# Altium schematic sheet High Voltage H-Bridge.SchDoc: High Voltage H-Bridge
size Letter; Date: 2017-01-26; DocumentNumber: 7; Revision: A; SheetNumber: 7; SheetTotal: 16; DesignedBy: Mike MacKay
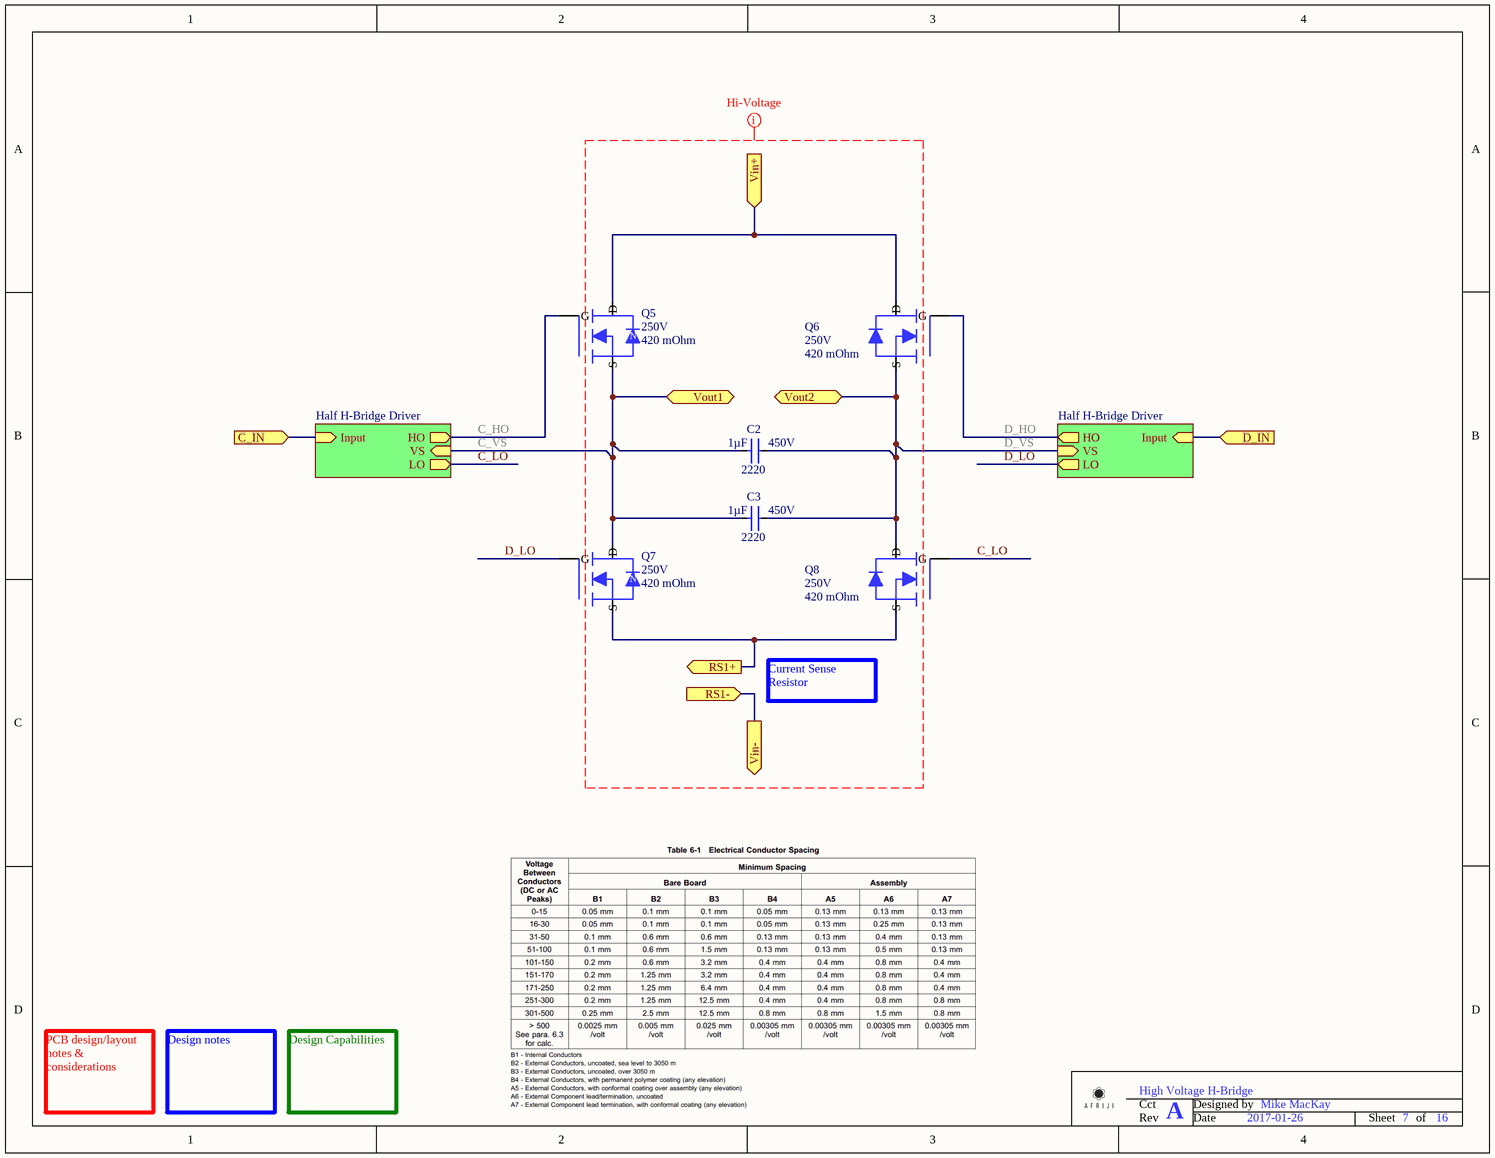
[diagram p0: High Voltage H-Bridge.SchDoc]

## Parts
C2  Capacitance: 1µF  Voltage - Rated: 450V  Package / Case: 2220  [C2220 - Ceramic]  (hidden comment: 1uF 2220 450V)
C3  Capacitance: 1µF  Voltage - Rated: 450V  Package / Case: 2220  [C2220 - Ceramic]  (hidden comment: 1uF 2220 450V)
Q5  Drain to Source Voltage (Vdss): 250V  Rds On (Max) @ Id, Vgs: 420 mOhm  [DPAK]  (hidden comment: N-MOSFET 420mR 250V)
Q6  Drain to Source Voltage (Vdss): 250V  Rds On (Max) @ Id, Vgs: 420 mOhm  [DPAK]  (hidden comment: N-MOSFET 420mR 250V)
Q7  Drain to Source Voltage (Vdss): 250V  Rds On (Max) @ Id, Vgs: 420 mOhm  [DPAK]  (hidden comment: N-MOSFET 420mR 250V)
Q8  Drain to Source Voltage (Vdss): 250V  Rds On (Max) @ Id, Vgs: 420 mOhm  [DPAK]  (hidden comment: N-MOSFET 420mR 250V)

## Sub-sheets
Half H-Bridge Driver = Half H-Bridge Driver.SchDoc: HO (out), VS (in), LO (out), Input (in)
Half H-Bridge Driver = Half H-Bridge Driver.SchDoc: HO (out), VS (in), LO (out), Input (in)

## Ports
C_IN (in), D_IN (in), RS1+ (out), RS1- (in), Vin+ (in), Vin- (out), Vout1 (bidir), Vout2 (bidir)

## Nets
C_HO: Q5.1(G) ; sheet Half H-Bridge Driver/HO
C_IN: port C_IN, sheet Half H-Bridge Driver/Input
C_LO: Q8.1(G) ; sheet Half H-Bridge Driver/LO
C_VS: C2.1 C3.1 Q5.3(S) Q7.2(D) ; port Vout1, sheet Half H-Bridge Driver/VS
D_HO: Q6.1(G) ; sheet Half H-Bridge Driver/HO
D_IN: port D_IN, sheet Half H-Bridge Driver/Input
D_LO: Q7.1(G) ; sheet Half H-Bridge Driver/LO
D_VS: C2.2 C3.2 Q6.3(S) Q8.2(D) ; port Vout2, sheet Half H-Bridge Driver/VS
RS1+: Q7.3(S) Q8.3(S) ; port RS1+
RS1-: port Vin-, port RS1-
Vin+: Q5.2(D) Q6.2(D) ; port Vin+

## Layout directives
net class 171-250V: (no net found under the mark)

## Notes on the sheet
- Current Sense Resistor
- PCB design/layout notes & considerations
- Design notes
- Design Capabilities
- Cct
- Designed by
- Rev
- Date
- Sheet
- of
- (in symbol N-MOSFET 420mR 250V) N

## Library data of the parts
C2 C3 = 1uF 2220 450V: Manufacturer: TDK Corporation; Manufacturer Part Number: CGA9P4X7T2W105M250KE; Tolerance: ±20%; Temperature Coefficient: X7T; Supplier 1: Digi-Key; Supplier Part Number 1: 445-7998-1-ND; RoHS: RoHS Compliant; Category: Capacitors; Stock 1: 10247; Pricing 1: 1=3.11, 10=2.576, 100=2.1589, 250=1.78012 (USD); Packaging: Cut Tape (CT); Part Status: Active; Operating Temperature: -55°C ~ 125°C; Features: Soft Termination; Ratings: AEC-Q200; Applications: Automotive, Boardflex Sensitive; Failure Rate: -; Mounting Type: Surface Mount, MLCC; Size / Dimension: 0.224" L x 0.197" W (5.70mm x 5.00mm); Height - Seated (Max): -; Thickness (Max): 0.098" (2.50mm); Lead Spacing: -; Lead Style: -; ComponentLink1URL: https://product.tdk.com/info/en/catalog/datasheets/mlcc_automotive_soft_en.pdf; ComponentLink1Description: Spec Sheet; Value: 1uF 2220 450V
Q5-Q8 = N-MOSFET 420mR 250V: Manufacturer: Fairchild/ON Semiconductor; Manufacturer Part Number: FQD9N25TM; FET Type: N-Channel; Current - Continuous Drain (Id) @ 25°C: 7.4A (Tc); Drive Voltage (Max Rds On,  Min Rds On): 10V; Vgs(th) (Max) @ Id: 5V @ 250µA; Gate Charge (Qg) (Max) @ Vgs: 20nC @ 10V; Input Capacitance (Ciss) (Max) @ Vds: 700pF @ 25V; Vgs (Max): ±30V; Power Dissipation (Max): 2.5W (Ta), 55W (Tc); Supplier 1: Digi-Key; Supplier Part Number 1: FQD9N25TMCT-ND; RoHS: RoHS Compliant; Category: Discrete Semiconductor Products; Stock 1: 4941; Pricing 1: 1=0.86, 10=0.766, 100=0.597, 500=0.49316, 1000=0.38934 (USD); Packaging: Cut Tape (CT); Part Status: Active; Technology: MOSFET (Metal Oxide); FET Feature: -; Operating Temperature: -55°C ~ 150°C (TJ); Mounting Type: Surface Mount; Supplier Device Package: D-Pak; Package / Case: TO-252-3, DPak (2 Leads + Tab), SC-63; ComponentLink1URL: https://www.fairchildsemi.com/datasheets/FQ/FQD9N25.pdf; ComponentLink1Description: Spec Sheet